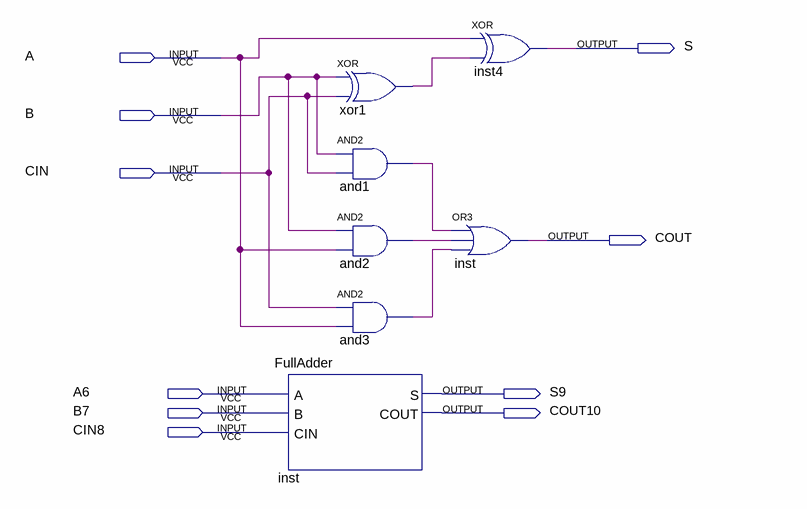
[diagram p0: schematic sheet]
// Quartus schematic Block1.bdf as structural Verilog: 7 symbols, 10 pins
module Block1 (
  input  A,
  input  B,
  input  CIN,
  input  A6,
  input  B7,
  input  CIN8,
  output S,
  output COUT,
  output S9,
  output COUT10
);

  wire and1_out, and2_out, and3_out, xor1_out;

  FullAdder inst (.A(A6), .B(B7), .CIN(CIN8), .S(S9), .COUT(COUT10));
  xor xor1 (xor1_out, B, CIN);
  and and1 (and1_out, B, CIN);
  and and2 (and2_out, B, A);
  and and3 (and3_out, CIN, A);
  xor inst4 (S, A, xor1_out);
  or inst_dup2 (COUT, and1_out, and2_out, and3_out);
endmodule
